# EAGLE design balloon3.1 (EAGLE 7.3.0)
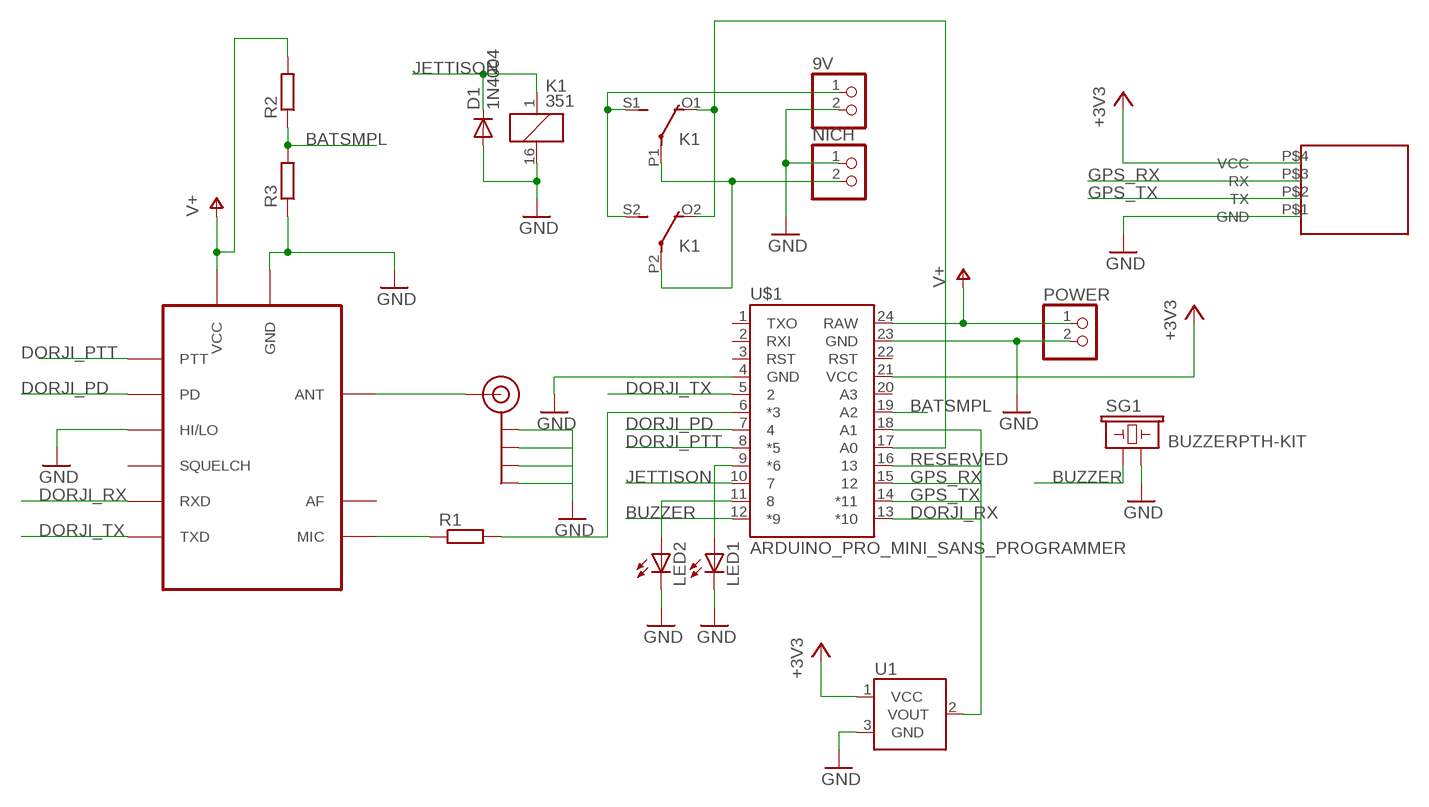
[diagram p0: schematic, sheet 1]

## Parts
9V  PINHD-1X2  [1X02]
D1  1N4004  [DO41-10]
J$1  SMA_EDGE  [SMA-EDGE]
K1  351  [351]
LED1  LED3MM  [LED3MM]
LED2  LED3MM  [LED3MM]
NICH  PINHD-1X2  [1X02]
POWER  PINHD-1X2  [1X02]
R1  R-EU_0204/7  [0204/7]
R2  R-EU_0204/7  [0204/7]
R3  R-EU_0204/7  [0204/7]
SG1  BUZZERPTH-KIT  [BUZZER-12MM-KIT]
U1  TMP36GT9  [TO-92]
U$1  ARDUINO_PRO_MINI_SANS_PROGRAMMER  [ARDUINO_PRO_MINI]
U$2  DORJI  [DORJI]
U$3  NEO-6M-MODULE  [NEO-6M-MODULE]

## Nets
+3V3: U1.1(VCC) U$1.21(VCC) U$3.P$4(VCC)
BATSMPL: R2.1 R3.2 U$1.19(A2)
BUZZER: SG1.+ U$1.12(*9)
DORJI_PD: U$1.7 U$2.P$6(PD)
DORJI_PTT: U$1.8(*5) U$2.P$5(PTT)
DORJI_RX: U$1.13(*10) U$2.P$16(RXD)
DORJI_TX: U$1.5 U$2.P$17(TXD)
GND: 9V.2 D1.A J$1.GND@0(GND) J$1.GND@1(GND) J$1.GND@2(GND) J$1.GND@3(GND) K1.16 LED1.K(C) LED2.K(C) NICH.1 POWER.2 R3.1 SG1.- U1.3(GND) U$1.4(GND) U$1.23(GND) U$2.P$7(HI/LO) U$2.P$9(GND) U$2.P$10(GND) U$3.P$1(GND)
GPS_RX: U$1.15 U$3.P$3(RX)
GPS_TX: U$1.14(*11) U$3.P$2(TX)
JETTISON: D1.C K1.1 U$1.10
N$1: R1.2 U$1.6(*3)
N$2: R1.1 U$2.P$18(MIC)
N$3: J$1.SIG(SIGNAL) U$2.P$12(ANT)
N$4: K1.P1(2:P) K1.P2(3:P) NICH.2
N$5: LED1.A U$1.9(*6)
N$6: 9V.1 K1.S1(2:S) K1.S2(3:S)
N$7: K1.O1(2:O) K1.O2(3:O) U$1.17(A0)
N$8: U1.2(VOUT) U$1.18(A1)
N$9: LED2.A U$1.11
RESERVED: U$1.16
V+: POWER.1 R2.2 U$1.24(RAW) U$2.P$8(VCC)
Unconnected: U$1.1(TXO) U$1.2(RXI) U$1.3(RST) U$1.20(A3) U$1.22(RST) U$2.P$1(SQUELCH) U$2.P$3(AF)

## Library data of the parts
9V NICH POWER = pinhead:PINHD-1X2: PIN HEADER
D1 = diode:1N4004: DIODE general purpose rectifier, 1 A
J$1 = SparkFun-Connectors:SMA_EDGE: SMA Antenna Connector End launch SMA connector. The paste layer has been removed so that the connector can be hand soldered onto the board after reflow.
K1 = relay:351: RELAY 2 x switch, Omron; OC_FARNELL: unknown; OC_NEWARK: unknown
LED1 LED2 = adafruit:LED: LED OSRAM: - CHIPLED LG R971, LG N971, LY N971, LG Q971, LY Q971, LO R971, LY R971 LH N974, LH R974 LS Q976, LO Q976, LY Q976 LO Q996 - Hyper CHIPLED LW Q18S LB Q993, LB Q99A, LB R99A - SideLED LS A670, LO A670, LY A670, LG A670, LP A670 LB A673, LV A673, LT A673, LW A673 LH A674 LY A675 LS A676, LA A676, LO A676, LY A676, LW A676 LS A679, LY A679, LG A679 - Hyper Micro SIDELED® LS Y876, LA Y876, LO Y876, LY Y876 LT Y87S - SmartLED LW L88C, LW L88S LB L89C, LB L89S, LG L890 LS L89K, LO L89K, LY L89K LS L896, LA L896, LO L896, LY L896 - TOPLED LS T670, LO T670, LY T670, LG T670, LP T670 LSG T670, LSP T670, LSY T670, LOP T670, LYG T670 LG T671, LOG T671, LSG T671 LB T673, LV T673, LT T673, LW T673 LH T674 LS T676, LA T676, LO T676, LY T676, LB T676, LH T676, LSB T676, LW T676 LB T67C, LV T67C, LT T67C, LS T67K, LO T67K, LY T67K, LW E67C LS E67B, LA E67B, LO E67B, LY E67B, LB E67C, LV E67C, LT E67C LW T67C LS T679, LY T679, LG T679 LS T770, LO T770, LY T770, LG T770, LP T770 LB T773, LV T773, LT T773, LW T773 LH T774 LS E675, LA E675, LY E675, LS T675 LS T776, LA T776, LO T776, LY T776, LB T776 LHGB T686 LT T68C, LB T68C - Hyper Mini TOPLED® LB M676 - Mini TOPLED Santana® LG M470 LS M47K, LO M47K, LY M47K Source: http://www.osram.convergy.de/
R1-R3 = resistor:R-EU_: RESISTOR, European symbol
SG1 = SparkFun-Electromechanical:BUZZER: Buzzer 12mm Spark Fun Electronics SKU : Comp-Buzzer; PROD_ID: COMP-08253
U1 = SparkFun-Sensors:TMP36: Precision degC temp sensor, analog out
U$1 = ido:ARDUINO_PRO_MINI_SANS_PROGRAMMER
U$2 = dorji:DORJI: DRA818V 2-Meter transceiver modul
U$3 = ido:NEO-6M-MODULE

## Board
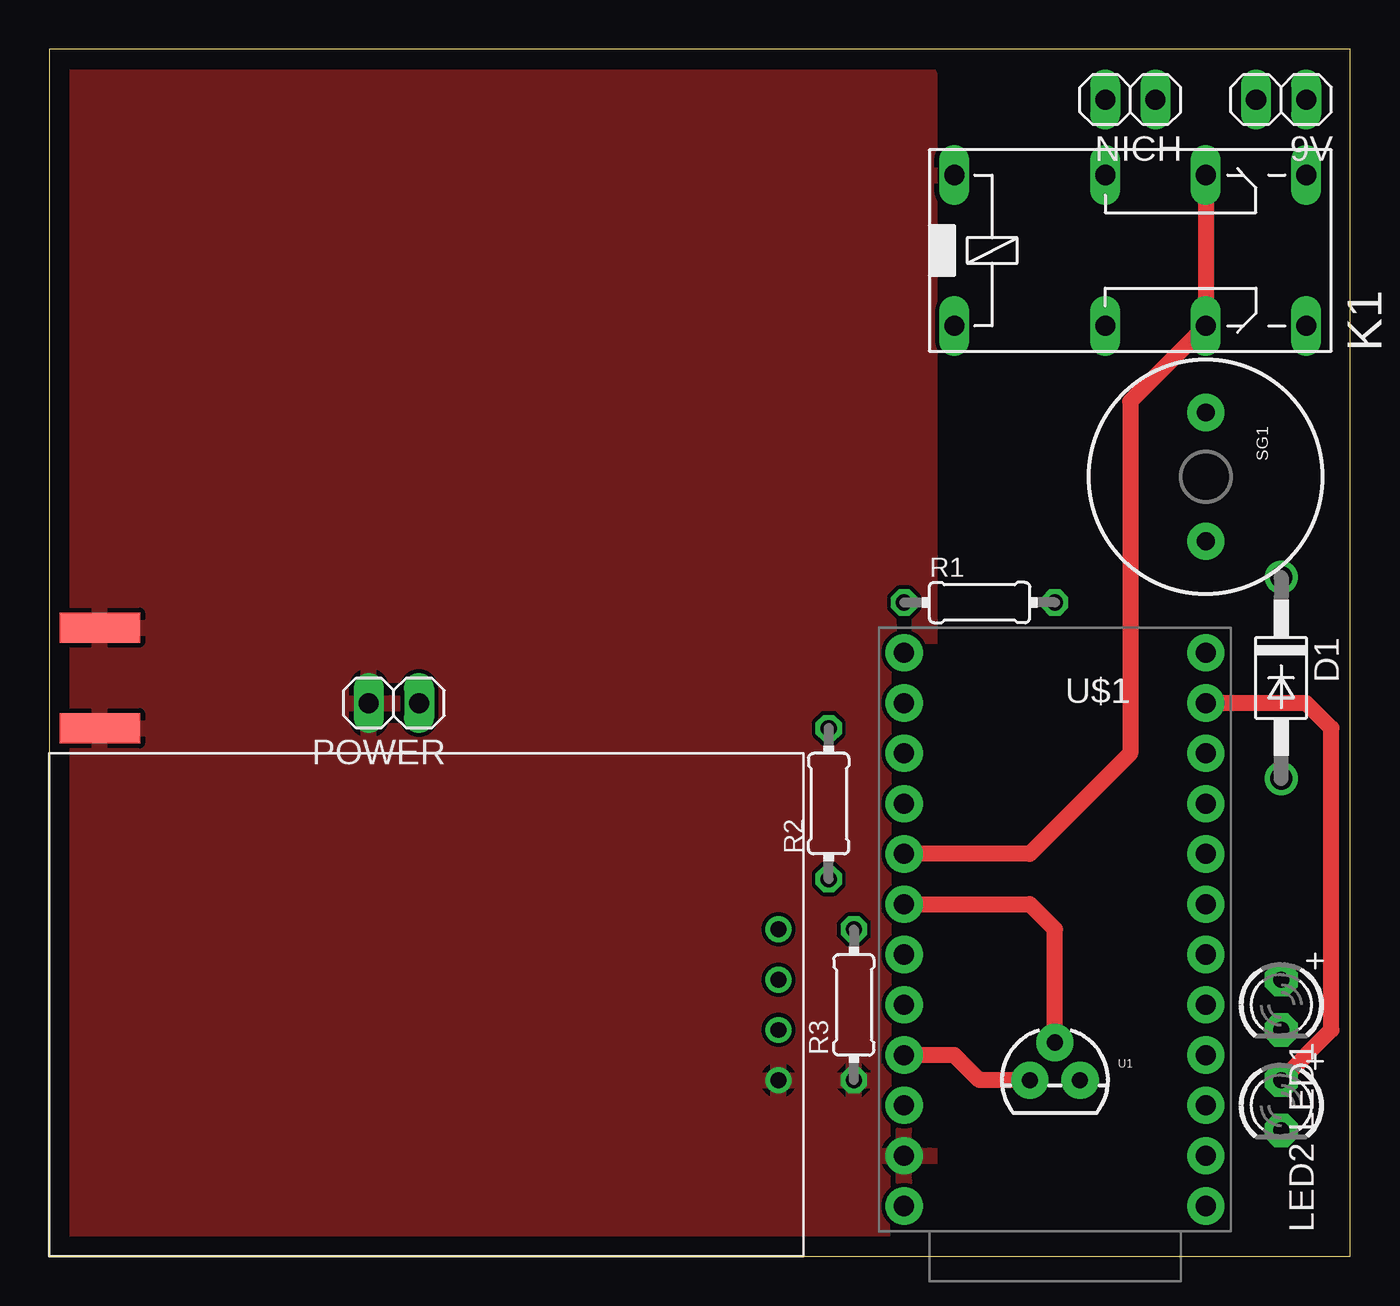
[diagram p1: board, top side]
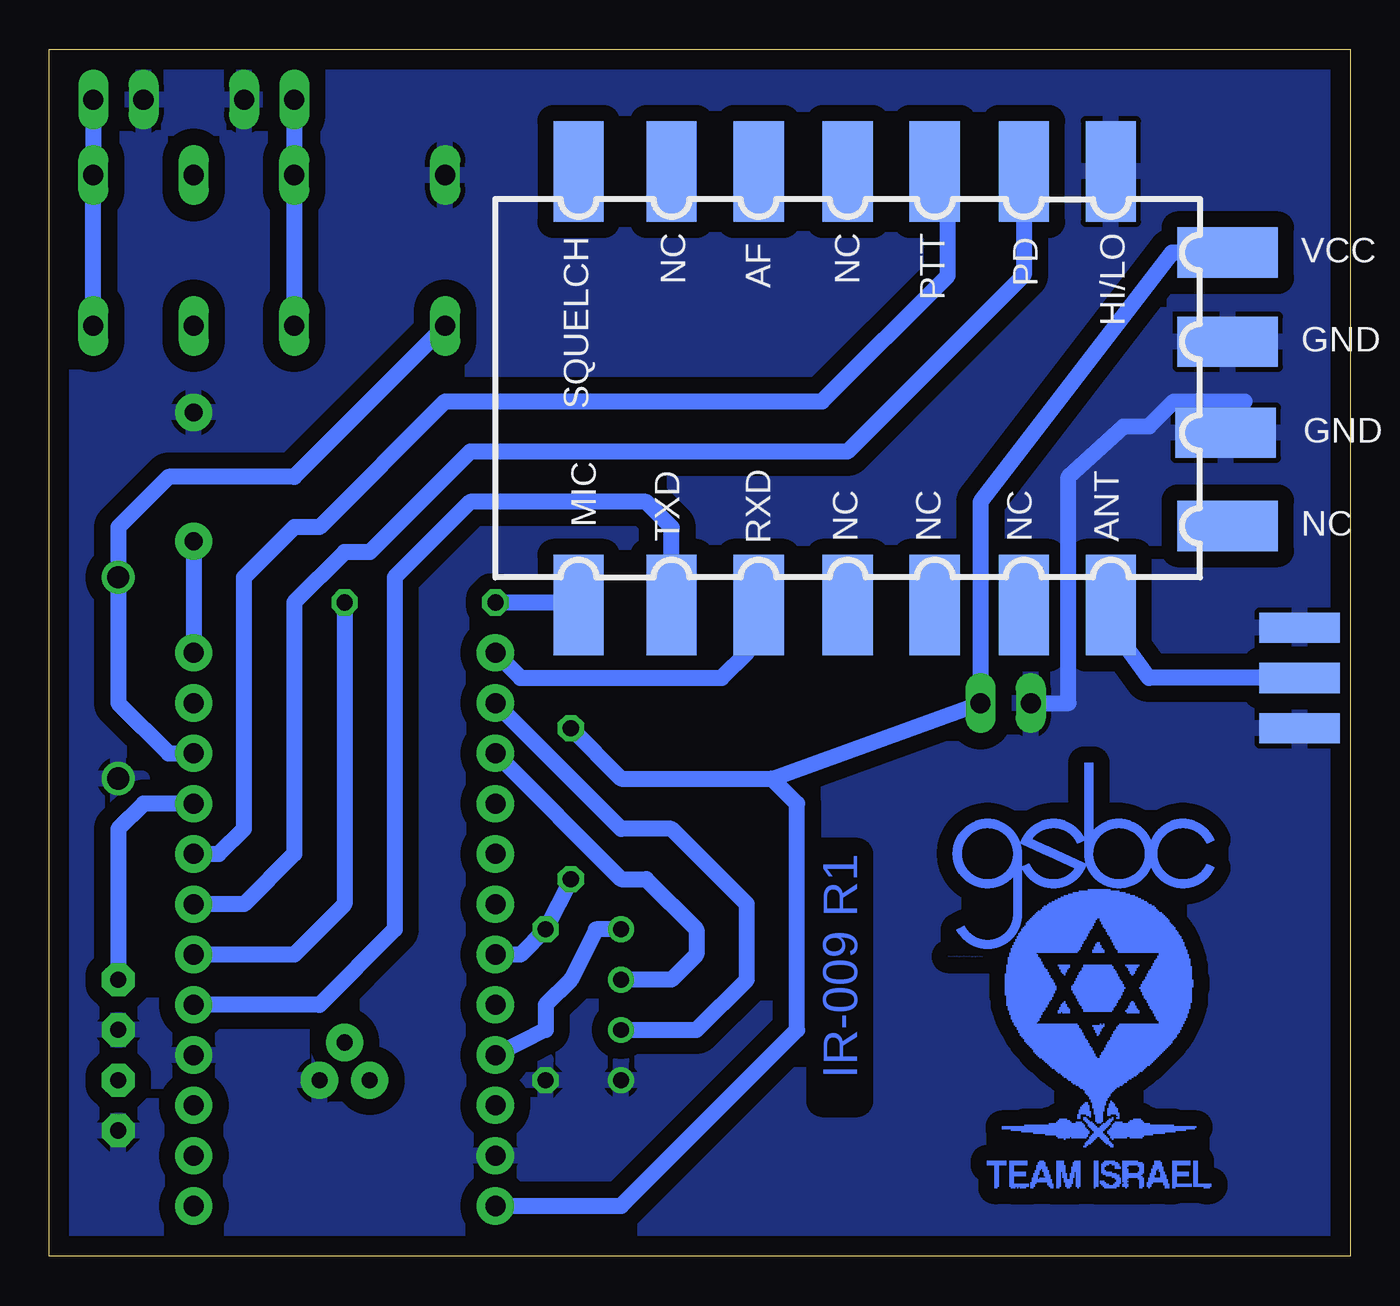
[diagram p2: board, bottom side, seen from below]

Size 65.71 x 60.95 mm. Coordinates in mm from the lower left corner, seen from the top.
Outline: 0,0 65.71,0 65.71,60.95 0,60.95 0,0
Copper layers (1*16): Top 0.035mm / dielectric 1.5mm / Bottom 0.035mm
Design rules "default": minimum track width 10mil, minimum drill 24mil, track to track 8mil, track to pad 8mil, pad to pad 8mil, via to via 8mil, smd to smd 8mil, copper to edge 40mil, drill to drill 8mil, minimum pad ring 10mil, minimum via ring 8mil, stop-mask expansion 4mil, vias tented up to drill 0mil, thermal gap 10mil

### Footprints (pad centres in the part's own frame; a part is rotated, then mirrored left to right if it is on the bottom)
1X02 = drill 1.016 long: 1 -1.27,0; 2 1.27,0
DO41-10 = drill 1.118: A 5.08,0; C -5.08,0
SMA-EDGE = smd 1.524 x 4.064: GND@0 0,0; GND@1 5.08,0; SIG 2.54,0 | smd 1.524 x 4.064 bottom: GND@2 0,0; GND@3 5.08,0
351 = drill 1.016 long: 1 -3.81,-3.81; 16 -3.81,3.81; O1 8.89,-3.81; O2 8.89,3.81; P1 3.81,-3.81; P2 3.81,3.81; S1 13.97,-3.81; S2 13.97,3.81
LED3MM = drill 0.813 pad 1.676 octagon: A -1.27,0; K 1.27,0
0204/7 = drill 0.813 octagon: 1 -3.81,0; 2 3.81,0
BUZZER-12MM-KIT = drill 0.9 pad 1.88: + 3.25,0; - -3.25,0
TO-92 = drill 0.813 pad 1.88: 1 -1.27,0; 2 0,1.905; 3 1.27,0
ARDUINO_PRO_MINI = drill 1.016 pad 1.88: 1 1.27,29.21; 2 1.27,26.67; 3 1.27,24.13; 4 1.27,21.59; 5 1.27,19.05; 6 1.27,16.51; 7 1.27,13.97; 8 1.27,11.43; 9 1.27,8.89; 10 1.27,6.35; 11 1.27,3.81; 12 1.27,1.27; 13 16.51,1.27; 14 16.51,3.81; 15 16.51,6.35; 16 16.51,8.89; 17 16.51,11.43; 18 16.51,13.97; 19 16.51,16.51; 20 16.51,19.05; 21 16.51,21.59; 22 16.51,24.13; 23 16.51,26.67; 24 16.51,29.21
DORJI = smd 2.54 x 5.08: P$1 4.2,20.5; P$2 8.9,20.5; P$3 13.3,20.5; P$4 17.8,20.5; P$5 22.2,20.5; P$6 26.7,20.5; P$7 31.1,20.5; P$12 31.1,-1.4; P$13 26.7,-1.4; P$14 22.2,-1.4; P$15 17.8,-1.4; P$16 13.3,-1.4; P$17 8.9,-1.4; P$18 4.2,-1.4 | smd 5.08 x 2.54: P$8 37,16.4; P$9 37,11.9; P$10 36.9,7.3; P$11 37,2.6
NEO-6M-MODULE = drill 0.8: P$1 1.27,16.51; P$2 1.27,13.97; P$3 1.27,11.43; P$4 1.27,8.89

### Placement (x,y rotation side)
9V  62.23,58.42 180 top
D1  62.23,29.21 270 top
J$1  2.54,26.67 90 bottom
K1  49.53,50.8 0 top
LED1  62.23,12.7 270 top
LED2  62.23,7.62 270 top
NICH  54.61,58.42 180 top
POWER  17.4,27.94 180 top
R1  46.99,33.02 0 top
R2  39.37,22.86 90 top
R3  40.64,12.7 90 top
SG1  58.42,39.37 270 top
U1  50.8,8.89 0 top
U$1  59.69,31.75 180 top
U$2  43.18,34.29 0 bottom
U$3  38.1,25.4 180 top
U$4  [GSBC]  20.32,15.24 0 bottom
U$5  [TEAMISRAEL]  21.59,1.27 0 bottom

### Tracks (layer width: path | path; a pad name or v marks a point on that pad's centre or on a via)
+3V3
  Top 0.813: U1.1 46.99,8.89 45.72,10.16 U$1.21
  Bottom 0.813: U$3.P$4 38.1,16.51 39.37,13.97 40.64,12.7 40.64,11.43 U$1.21
BATSMPL
  Bottom 0.813: R2.1 R3.2 41.91,15.24 U$1.19
BUZZER
  Bottom 0.813: SG1.+ U$1.12
DORJI_PD
  Bottom 0.813: U$2.P$6 16.48,49.56 25.4,40.64 44.45,40.64 49.53,35.56 50.8,35.56 53.34,33.02 53.34,20.32 55.88,17.78 U$1.7
DORJI_PTT
  Bottom 0.813: U$1.8 57.15,20.32 55.88,21.59 55.88,34.29 53.34,36.83 52.07,36.83 45.72,43.18 26.67,43.18 20.32,49.53 20.32,55.45 U$2.P$5
DORJI_RX
  Bottom 0.813: U$1.13 41.91,29.21 31.75,29.21 30.48,30.48 30.48,32.29 U$2.P$16
DORJI_TX
  Bottom 0.813: U$2.P$17 34.28,36.82 35.56,38.1 44.45,38.1 48.26,34.29 48.26,16.51 52.07,12.7 U$1.5
GND
  Bottom 0.813: POWER.2 14.22,27.94 14.22,39.37 11.43,41.91 10.16,41.91 8.89,43.18 5.33,43.18 U$2.P$10
  pour Bottom (isolate 0.813): 0,0 0,60.96 64.77,60.96 64.77,0
  pour Top: 0,0 0,59.69 44.45,59.69 44.45,0
GPS_RX
  Bottom 0.813: U$3.P$3 34.29,13.97 33.02,15.24 33.02,16.51 35.56,19.05 36.83,19.05 U$1.15
GPS_TX
  Bottom 0.813: U$3.P$2 33.02,11.43 30.48,13.97 30.48,17.78 34.29,21.59 36.83,21.59 U$1.14
JETTISON
  Bottom 0.813: K1.1 53.34,39.37 59.69,39.37 62.23,36.83 D1.C 62.23,27.94 59.69,25.4 U$1.10
N$1
  Bottom 0.813: R1.2 50.8,17.78 53.34,15.24 U$1.6
N$2
  Bottom 0.813: R1.1 38.85,33.02 U$2.P$18
N$3
  Bottom 0.813: J$1.SIG 10.16,29.21 11.43,30.97 U$2.P$12
N$4
  Bottom 0.813: NICH.2 K1.P2 K1.P1
N$5
  Bottom 0.813: U$1.9 60.96,22.86 62.23,21.59 LED1.A
N$6
  Bottom 0.813: 9V.1 K1.S2 K1.S1
N$7
  Top 0.813: K1.O2 K1.O1 54.61,43.18 54.61,25.4 49.53,20.32 U$1.17
N$8
  Top 0.813: U1.2 50.8,16.51 49.53,17.78 U$1.18
N$9
  Top 0.813: LED2.A 64.77,11.43 64.77,26.67 63.5,27.94 U$1.11
V+
  Bottom 0.813: R2.2 36.83,24.13 29.21,24.13 | 29.21,24.13 POWER.1 18.67,38.1 9,50.69 U$2.P$8 | U$1.24 36.83,2.54 27.94,11.43 27.94,22.86 29.21,24.13

### Text on the board
Bottom: IR-009 R1